# Altium schematic sheet Sheet1.SchDoc
size A4
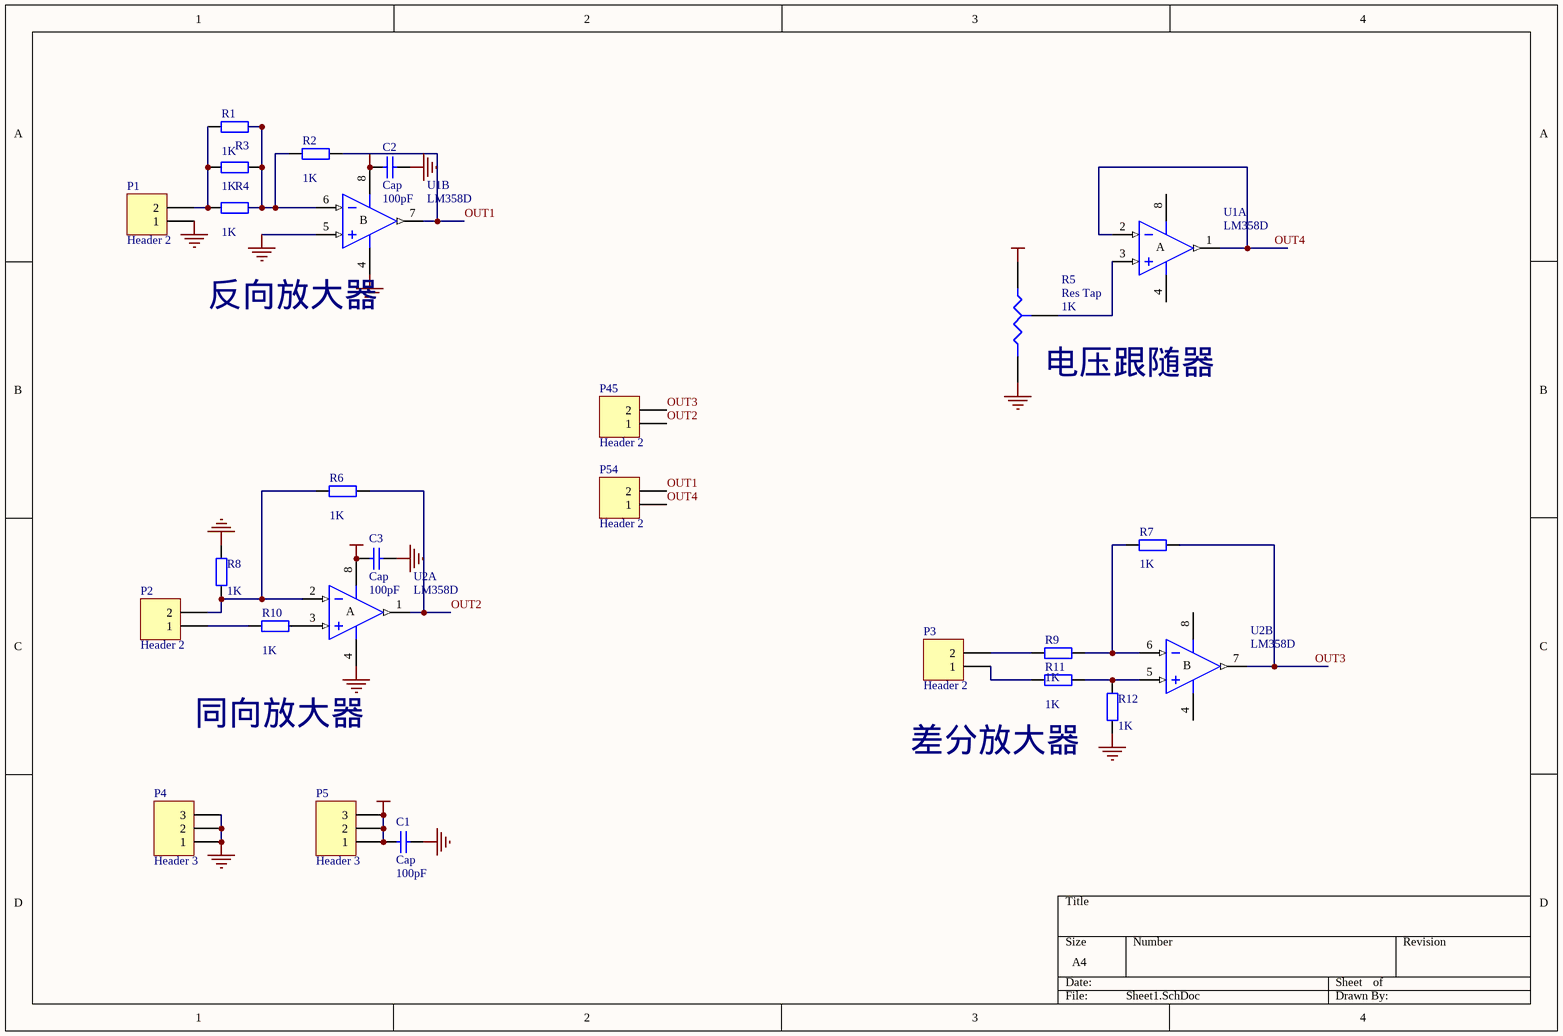
[diagram p0: Sheet1.SchDoc]

## Parts
C1  Cap  value 100pF  [6-0805]
C2  Cap  value 100pF  [6-0805]
C3  Cap  value 100pF  [6-0805]
P1  Header 2  [HDR1X2]
P2  Header 2  [HDR1X2]
P3  Header 2  [HDR1X2]
P4  Header 3  [HDR1X3]
P5  Header 3  [HDR1X3]
P45  Header 2  [HDR1X2]
P54  Header 2  [HDR1X2]
R1  value 1K  [6-0805]  (hidden comment: Res2)
R2  value 1K  [6-0805]  (hidden comment: Res2)
R3  value 1K  [6-0805]  (hidden comment: Res2)
R4  value 1K  [6-0805]  (hidden comment: Res2)
R5  Res Tap  value 1K  [HDR1X3]
R6  value 1K  [6-0805]  (hidden comment: Res2)
R7  value 1K  [6-0805]  (hidden comment: Res2)
R8  value 1K  [6-0805]  (hidden comment: Res2)
R9  value 1K  [6-0805]  (hidden comment: Res2)
R10  value 1K  [6-0805]  (hidden comment: Res2)
R11  value 1K  [6-0805]  (hidden comment: Res2)
R12  value 1K  [6-0805]  (hidden comment: Res2)
U1  LM358D  [D008_L]  (parts A,B of 2)
U2  LM358D  [D008_L]  (parts A,B of 2)

## Nets
+12: C1.1 C2.1 C3.1 P5.1 P5.2 P5.3 R5.1(A) U1.8(V+) U2.8(V+)
GND: C1.2 C2.2 C3.2 P1.1 P4.1 P4.2 P4.3 R5.3(B) R8.1 R12.1 U1.4(V-) U1.5(IN+) U2.4(V-)
OUT1: P54.2 R2.1 U1.7(OUT)
OUT2: P45.1 R6.1 U2.1(OUT)
OUT3: P45.2 R7.2 U2.7(OUT)
OUT4: P54.1 U1.1(OUT) U1.2(IN-)
NetP1_2: P1.2 R1.1 R3.1 R4.1
NetP2_1: P2.1 R10.1
NetP2_2: P2.2 R6.2 R8.2 U2.2(IN-)
NetP3_1: P3.1 R11.1
NetP3_2: P3.2 R9.1
NetR1_2: R1.2 R2.2 R3.2 R4.2 U1.6(IN-)
NetR5_2: R5.2(TAP) U1.3(IN+)
NetR7_1: R7.1 R9.2 U2.6(IN-)
NetR10_2: R10.2 U2.3(IN+)
NetR11_2: R11.2 R12.2 U2.5(IN+)

## Notes on the sheet
- 反向放大器
- (near R5) 电压跟随器
- 同向放大器
- 差分放大器
- (in symbol LM358D, part A) A
- (in symbol LM358D, part B) B

## Library data of the parts
C1-C3 = Cap: Capacitor; Published: 8-Jun-2000; LatestRevisionDate: 17-Jul-2002; LatestRevisionNote: Re-released for DXP Platform.; PackageReference: RAD-0.3; Publisher: Altium Limited
P1-P3 P45 P54 = Header 2: Header, 2-Pin; LatestRevisionDate: 17-Jul-2002; LatestRevisionNote: Re-released for DXP Platform.; Publisher: Altium Limited
P4 P5 = Header 3: Header, 3-Pin; LatestRevisionDate: 17-Jul-2002; LatestRevisionNote: Re-released for DXP Platform.; Publisher: Altium Limited
R1-R4 R6-R12 = Res2: Resistor; Published: 8-Jun-2000; LatestRevisionDate: 17-Jul-2002; LatestRevisionNote: Re-released for DXP Platform.; PackageReference: AXIAL-0.4; Publisher: Altium Limited
R5 = Res Tap: Tapped Resistor; Sim Note: Enter the Resistance value and the set point into parameter fields.; Set Position: 0.5; Published: 24-Mar-1999; LatestRevisionDate: 17-Jul-2002; LatestRevisionNote: Re-released for DXP Platform.; PackageReference: VR3; Publisher: Altium Limited
U1 U2 = LM358D: Dual Operational Amplifier; Published: 16-Jan-2001; LatestRevisionDate: 13-Apr-2006; LatestRevisionNote: IPC-7351 Footprint Added.; DatasheetVersion: Jul-1998; PackageVersion: Jan-1998; PackageReference: D008; Publisher: Altium Limited; PackageDescription: 8-Pin Small Outline Integrated Circuit 1.27 mm Pitch; Code_IPC: SOIC127P600-8; ComponentLink1Description: Manufacturer Link; ComponentLink1URL: http://www.ti.com/; ComponentLink2Description: Datasheet; ComponentLink2URL: http://www-s.ti.com/sc/ds/lm358.pdf